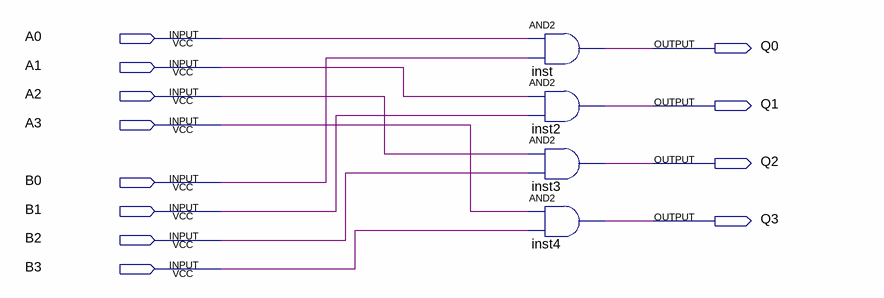
[diagram p0: schematic sheet]
// Quartus schematic 5_and_4_bits.bdf as structural Verilog: 4 symbols, 12 pins
module \5_and_4_bits  (
  input  A0,
  input  A1,
  input  A2,
  input  A3,
  input  B0,
  input  B1,
  input  B2,
  input  B3,
  output Q0,
  output Q1,
  output Q2,
  output Q3
);

  and inst (Q0, A0, B0);
  and inst2 (Q1, A1, B1);
  and inst3 (Q2, A2, B2);
  and inst4 (Q3, A3, B3);
endmodule
